# Altium schematic sheet SCH_Sensor-Wind_Altium.schdoc
size 238 x 160 mm
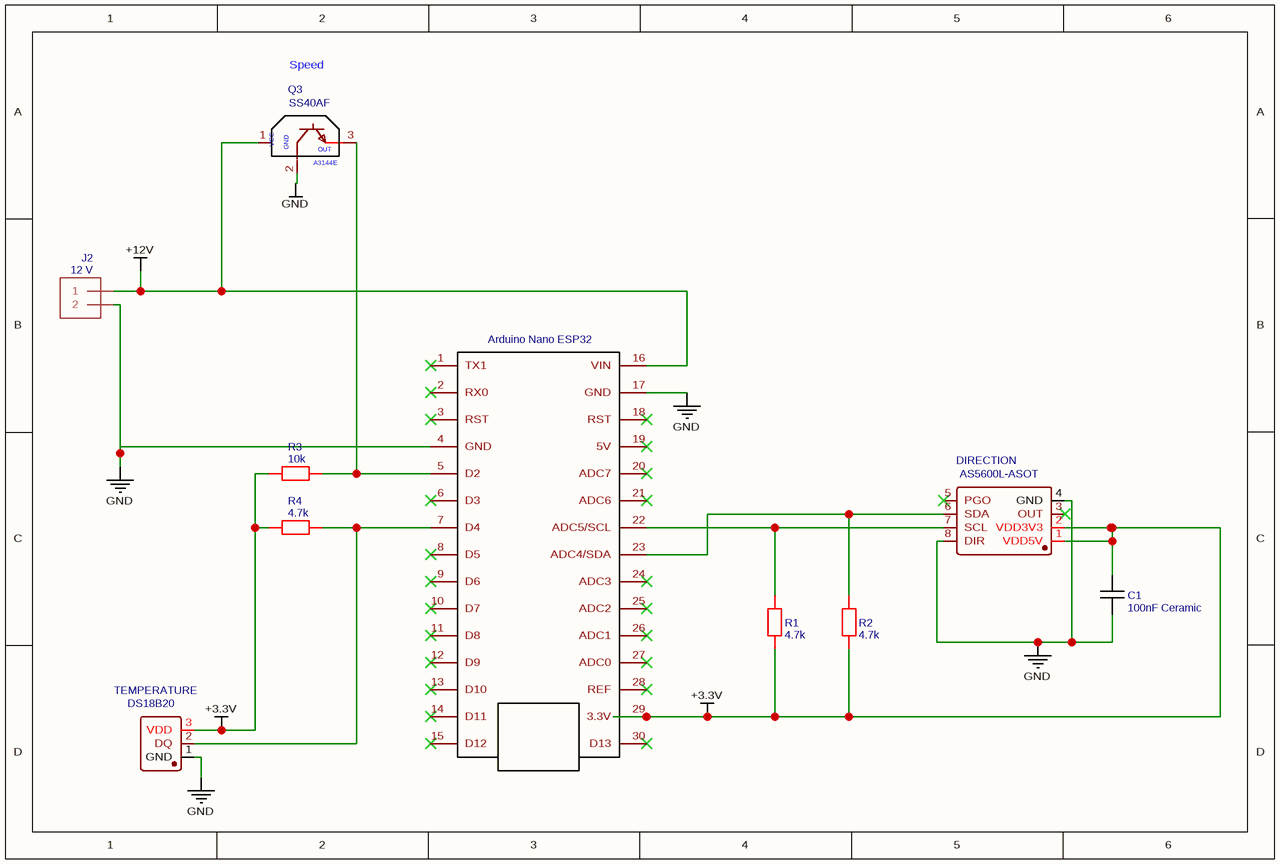
[diagram p0: SCH_Sensor-Wind_Altium.schdoc]

## Parts
C1  100nF Ceramic  [CERAMIC CAPACITOR]
DIRECTION  AS5600L-ASOT  [SOIC-8_L5.0-W4.0-P1.27-LS6.0-BL]
J2  12 V  [1X2-3.5MM]
Q3  SS40AF  [A3144E_HALLSENSOR_COPY]
R1  4.7k  [1K 0.25W]
R2  4.7k  [1K 0.25W]
R3  10k  [1K 0.25W]
R4  4.7k  [1K 0.25W]
TEMPERATURE  DS18B20  [TO-92-3_L4.9-W3.7-P1.27-L]
U1  Arduino Nano ESP32  [ADUINO NANO R3]

## Nets
+3.3V: C1.1 DIRECTION.1(VDD5V) DIRECTION.2(VDD3V3) R1.1 R2.1 R3.1 R4.1 TEMPERATURE.3(VDD) U1.29(3.3V)
+12V: J2.1 Q3.1(Supply) U1.16(VIN)
GND: C1.2 DIRECTION.4(GND) DIRECTION.8(DIR) J2.2 Q3.2(Ground) TEMPERATURE.1(GND) U1.4(GND) U1.17(GND)
NetDIRECTION_6: DIRECTION.6(SDA) R2.2 U1.23(ADC4/SDA)
NetDIRECTION_7: DIRECTION.7(SCL) R1.2 U1.22(ADC5/SCL)
NetQ3_3: Q3.3(Output) R3.2 U1.5(D2)
NetR4_2: R4.2 TEMPERATURE.2(DQ) U1.7(D4)

Not connected (* = marked no-connect by the designer): DIRECTION 3(OUT)* 5(PGO)*; U1 1(TX1)* 2(RX0)* 3(RST)* 6(D3)* 8(D5)* 9(D6)* 10(D7)* 11(D8)* 12(D9)* 13(D10)* 14(D11)* 15(D12)* 18(RST)* 19(5V)* 20(ADC7)* 21(ADC6)* 24(ADC3)* 25(ADC2)* 26(ADC1)* 27(ADC0)* 28(REF)* 30(D13)*

## Notes on the sheet
- Speed
- (in symbol SS40AF) VCC; GND; OUT; A3144E

## Library data of the parts
C1 = 100nF Ceramic: Manufacturer Part: Capacitor_Ceramic; Contributor: huuvinhz755; spicePre: C; spiceSymbolName: Capacitor_Ceramic
DIRECTION = AS5600L-ASOT: Manufacturer: 美国AMS; Contributor: LCSC; Supplier: LCSC; Supplier Part: C499458; Manufacturer Part: AS5600L-ASOT; spicePre: U; spiceSymbolName: AS5600L-ASOM
J2 = 12 V: Contributor: Adafruit; spicePre: J; spiceSymbolName: TERMBLOCK_1X2-3.5MM
Q3 = SS40AF: Manufacturer: Honeywell; Contributor: rakowski.hub; Manufacturer Part: SS40AF; Supplier Part: C778657; Supplier: LCSC; spicePre: Q; spiceSymbolName: A3144E_HALLSENSOR_COPY
R1 R2 R4 = 4.7k: Contributor: Kagutsuchi; spicePre: R; spiceSymbolName: 1w resistor
R3 = 10k: Contributor: Kagutsuchi; spicePre: R; spiceSymbolName: 1w resistor
TEMPERATURE = DS18B20: Manufacturer: Youtai Semiconductor Co., Ltd.; Contributor: LCSC; Supplier: LCSC; Supplier Part: C376006; Manufacturer Part: DS18B20; JLCPCB Part Class: Extended Part; spicePre: U; spiceSymbolName: DS18B20
U1 = Arduino Nano ESP32: Contributor: Nikolay Yanev; spicePre: U; spiceSymbolName: ARDUINO_NANO_R3